# EAGLE design ADXL362 BOB v01 (EAGLE 6.2)
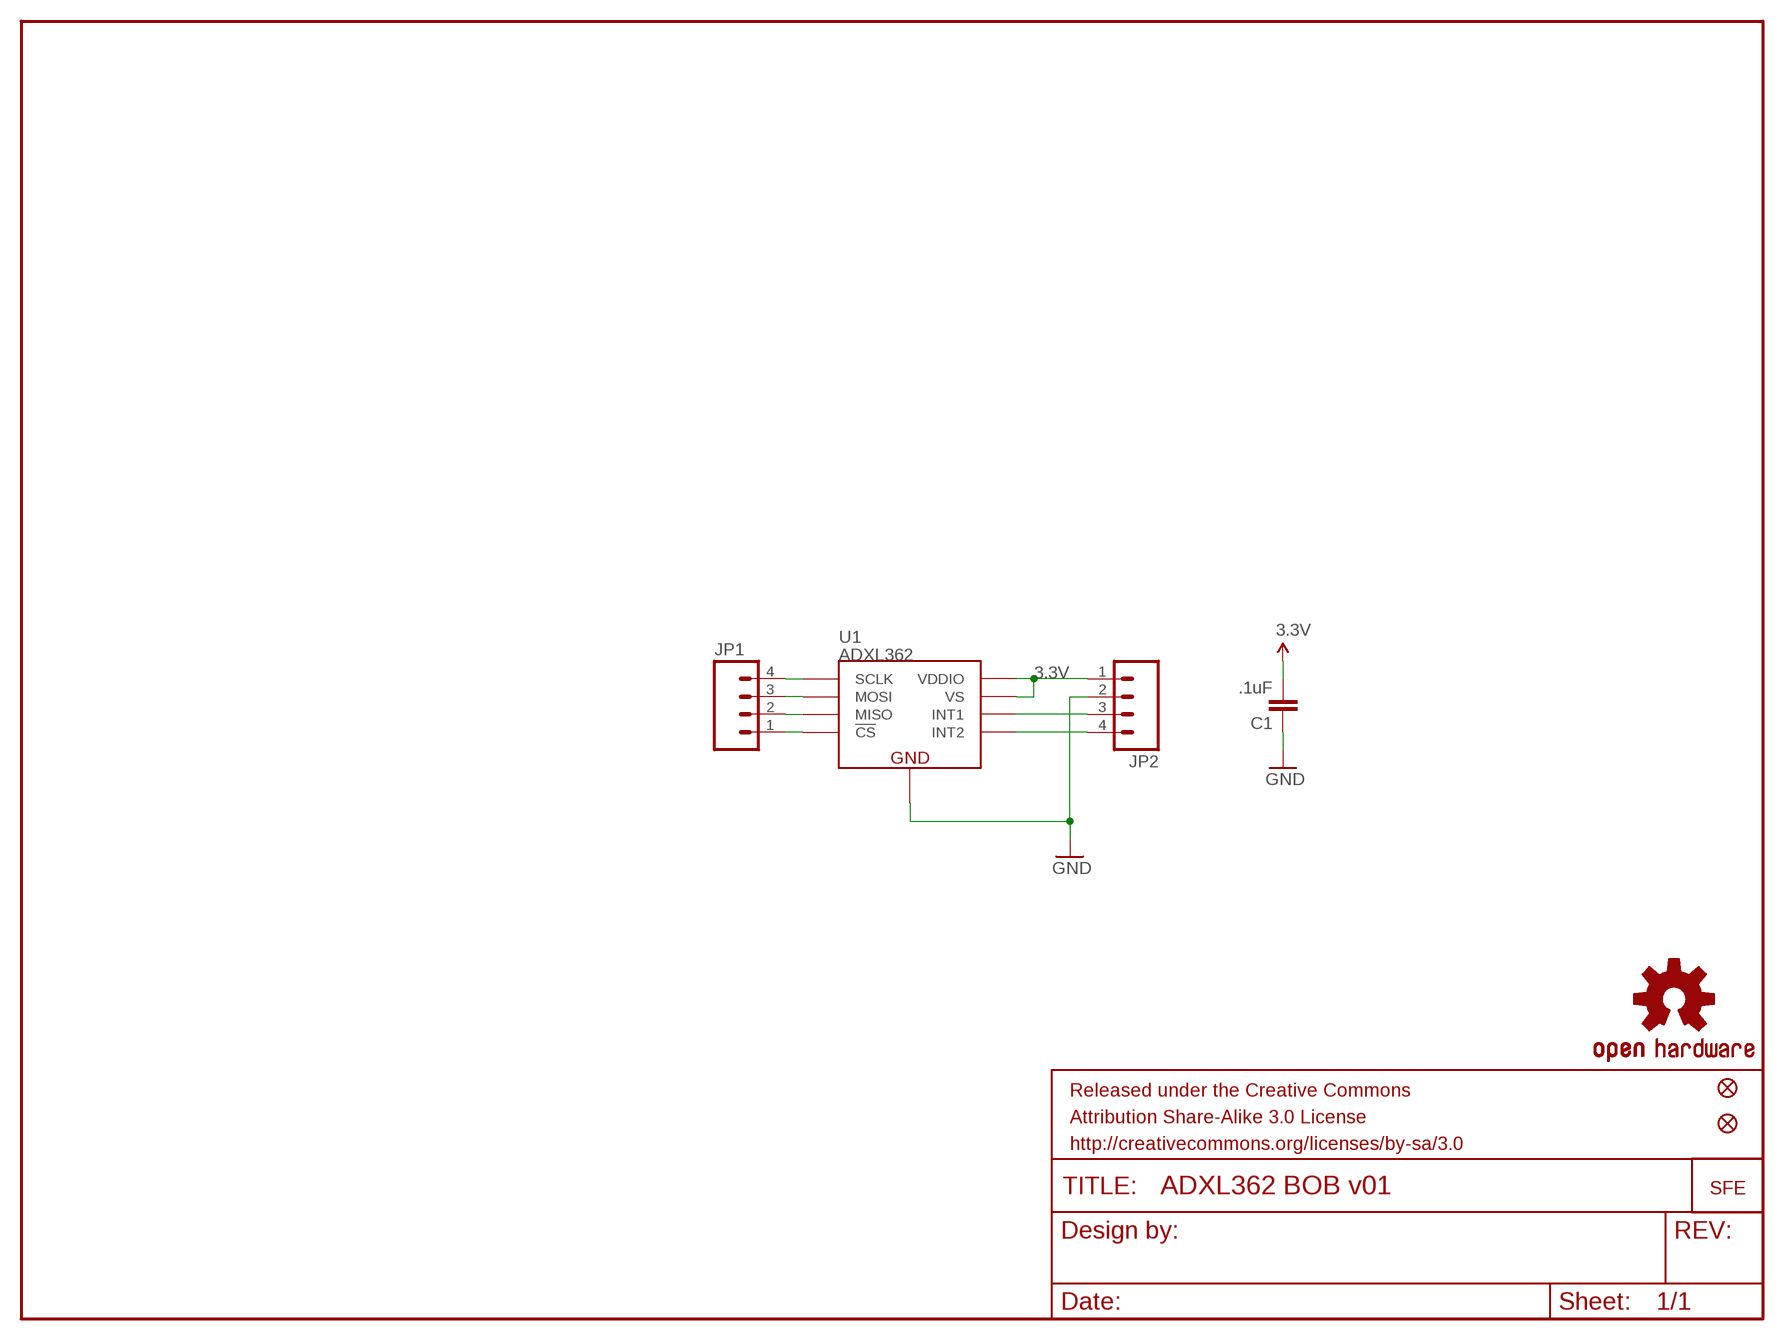
[diagram p0: schematic, sheet 1]

## Parts
C1  .1uF  CAP0402-CAP  [0402-CAP]
FRAME1  FRAME-LETTER  [CREATIVE_COMMONS]
JP1  M04PTH  [1X04]
JP2  M04PTH  [1X04]
JP3  LOGO-SFESK  [SFE-LOGO-FLAME]
JP4  FIDUCIALUFIDUCIAL  [MICRO-FIDUCIAL]
JP5  FIDUCIALUFIDUCIAL  [MICRO-FIDUCIAL]
U1  ADXL362  [ADXL362]
U$1  OSHW-LOGOS  [OSHW-LOGO-S]

## Nets
3.3V: C1.2 JP2.1 U1.P$1(VDDIO) U1.P$14(VS)
GND: C1.1 JP2.2 U1.P$12(GND) U1.P$13(GND) U1.P$16(GND)
N$1: JP1.4 U1.P$4(SCLK)
N$2: JP1.3 U1.P$6(MOSI)
N$3: JP1.2 U1.P$7(MISO)
N$4: JP1.1 U1.P$8(!CS)
N$7: JP2.3 U1.P$11(INT1)
N$8: JP2.4 U1.P$9(INT2)

## Library data of the parts
C1 = SparkFun-Passives:CAP: Capacitor Standard 0603 ceramic capacitor, and 0.1" leaded capacitor.; PROD_ID: CAP-00810
FRAME1 = SparkFun-Aesthetics:FRAME-LETTER: Schematic Frame Standard 8.5x11 US Letter frame
JP1 JP2 = SparkFun-Connectors:M04: Header 4 Standard 4-pin 0.1" header. Use with straight break away headers (SKU : PRT-00116), right angle break away headers (PRT-00553), swiss pins (PRT-00743), machine pins (PRT-00117), and female headers (PRT-00115). Molex polarized connector foot print use with SKU : PRT-08231 with associated crimp pins and housings. 1MM SMD Version SKU: PRT-10208
JP3 = SparkFun-Aesthetics:LOGO-SFE: Spark Fun Electronics PCB Logo This is the standard Spark Fun Electronics PCB logo.
JP4 JP5 = SparkFun:FIDUCIAL: Fiducial Alignment Points Various fiducial points for machine vision alignment.
U1 = SparkFun-Sensors:ADXL362: Micropower 3-axis accelerometer 2/4/8g digital output (SPI)
U$1 = SparkFun-Aesthetics:OSHW-LOGO: Open Source Hardware Logo This logo indicates the piece of hardware it is found on incorporates a OSHW license and/or adheres to the definition of open source hardware found here: http://freedomdefined.org/OSHW

## Board
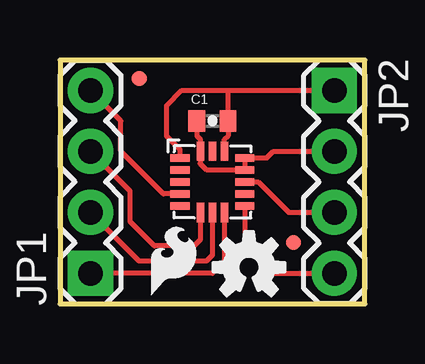
[diagram p1: board, top side]
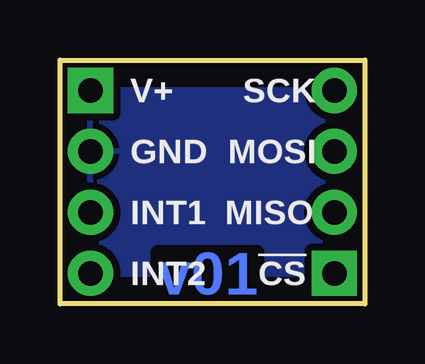
[diagram p2: board, bottom side, seen from below]

Size 12.7 x 10.16 mm. Coordinates in mm from the lower left corner, seen from the top.
Outline: 0,0 12.7,0 12.7,10.16 0,10.16 0,0
Copper layers (1*16): Top 0.035mm / dielectric 1.5mm / Bottom 0.035mm
Design rules: minimum track width 10mil, minimum drill 0.6mm, track to track 8mil, track to pad 8mil, pad to pad 8mil, via to via 8mil, smd to smd 8mil, copper to edge 40mil, drill to drill 8mil, minimum pad ring 10mil, minimum via ring 8mil, stop-mask expansion 4mil, vias tented up to drill 0mil, thermal gap 10mil

### Footprints (pad centres in the part's own frame; a part is rotated, then mirrored left to right if it is on the bottom)
0402-CAP = smd 0.7 x 0.9: 1 -0.65,0; 2 0.65,0
1X04 = drill 1.016 pad 1.88 square: 1 0,0 | drill 1.016 pad 1.88: 2 2.54,0; 3 5.08,0; 4 7.62,0
MICRO-FIDUCIAL = smd 0.635 x 0.635: 1 0,0
ADXL362 = smd 0.8 x 0.3: P$1 -1.35,1; P$2 -1.35,0.5; P$3 -1.35,0; P$4 -1.35,-0.5; P$5 -1.35,-1; P$9 1.35,-1; P$10 1.35,-0.5; P$11 1.35,0; P$12 1.35,0.5; P$13 1.35,1 | smd 0.3 x 0.8: P$6 -0.5,-1.275; P$7 0,-1.275; P$8 0.5,-1.275; P$14 0.5,1.275; P$15 0,1.275; P$16 -0.5,1.275

### Placement (x,y rotation side)
C1  6.35,7.62 0 top
FRAME1  -77.47,1.27 0 top  (outside the outline)
JP1  1.27,1.27 90 top
JP2  11.43,8.89 270 top
JP3  3.81,0.38 0 top
JP4  3.3,9.4 0 top
JP5  9.73,2.57 0 top
U1  6.35,5.08 0 top
U$1  7.87,1.52 0 top

### Tracks (layer width: path | path; a pad name or v marks a point on that pad's centre or on a via)
3.3V
  Top 0.203: U1.P$1 5,6.43 4.45,6.99 4.45,8.26 5.08,8.89 6.99,8.89 | 6.99,8.89 JP2.1 | 6.99,8.89 7,8.88 C1.2 7,7 6.85,6.85 U1.P$14
GND
  Top 0.203: JP2.2 8.89,6.35 8.62,6.08 U1.P$13 U1.P$12 6.1,5.59 5.84,5.84 U1.P$16 | C1.1 5.7,7 5.84,6.86 U1.P$16 | U1.P$16
  pour Bottom (isolate 0.305): 0,10.16 12.7,10.16 12.7,0 0,0
N$1
  Top 0.203: U1.P$4 4.31,4.58 2.54,6.35 2.54,7.62 JP1.4
N$2
  Top 0.203: U1.P$6 5.85,2.67 5.59,2.41 3.94,2.41 2.92,3.43 2.92,4.7 JP1.3
N$3
  Top 0.203: U1.P$7 6.35,2.03 6.1,1.78 3.3,1.78 JP1.2
N$4
  Top 0.203: U1.P$8 6.85,1.77 6.35,1.27 JP1.1
N$7
  Top 0.203: U1.P$11 8.26,5.08 9.53,3.81 JP2.3
N$8
  Top 0.203: U1.P$9 7.7,2.46 8.89,1.27 JP2.4

### Text on the board
Bottom: v01
bPlace: SCK | V+ | MOSI | GND | MISO | INT1 | !CS | INT2
tValues: Mike Hord